# EAGLE design BareDuino schematic (EAGLE 7.1.0)
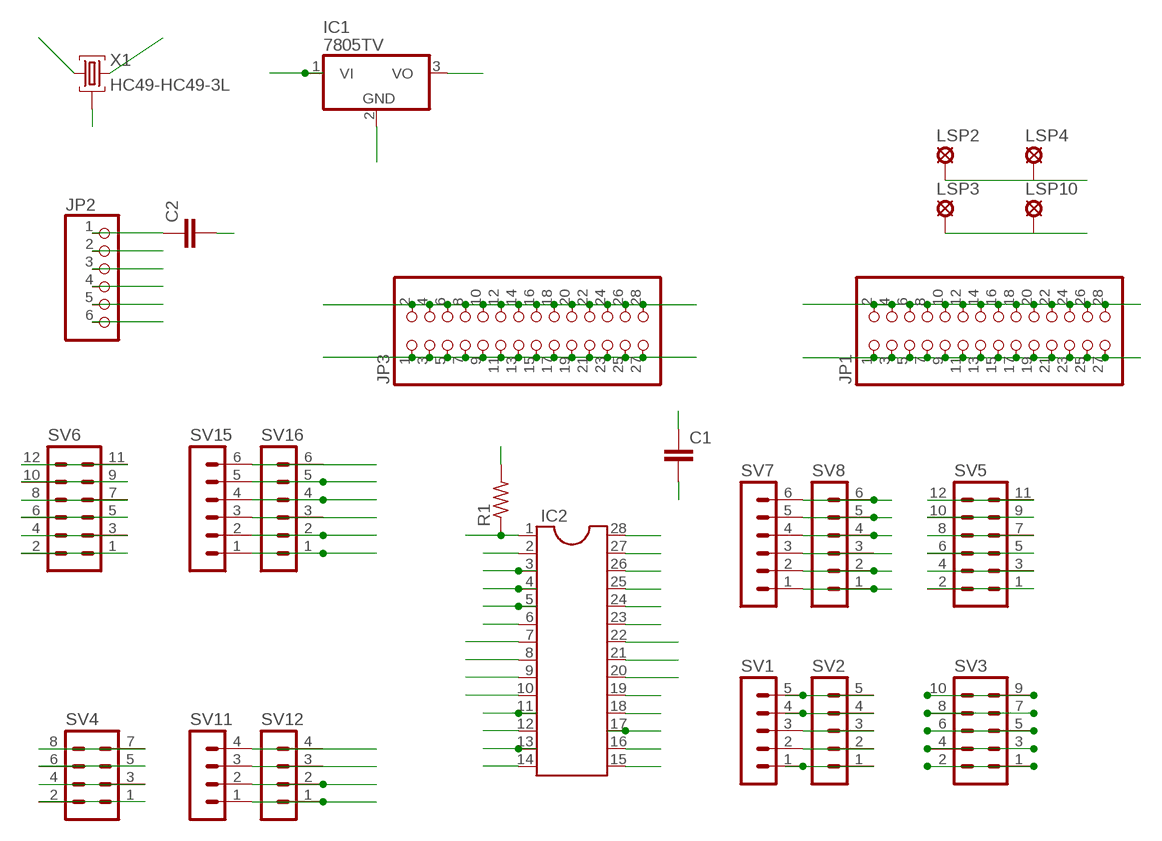
[diagram p0: schematic, sheet 1]

## Parts
C1  C5/2.5  [C5B2.5]
C2  C5/2.5  [C5B2.5]
IC1  7805TV  [TO220V]
IC2  DIL28-3  [DIL28-3]
JP1  PINHD-2X14  [2X14]
JP2  PINHD-1X6  [1X06]
JP3  PINHD-2X14  [2X14]
LSP2  SE14  [SE14]
LSP3  SE14  [SE14]
LSP4  LSP10  [LSP10]
LSP10  LSP10  [LSP10]
R1  R-US_0204/5  [0204/5]
SV1  MA05-1  [MA05-1]
SV2  MA05-1  [MA05-1]
SV3  MA05-2  [MA05-2]
SV4  MA04-2  [MA04-2]
SV5  MA06-2  [MA06-2]
SV6  MA06-2  [MA06-2]
SV7  MA06-1  [MA06-1]
SV8  MA06-1  [MA06-1]
SV11  MA04-1  [MA04-1]
SV12  MA04-1  [MA04-1]
SV15  MA06-1  [MA06-1]
SV16  MA06-1  [MA06-1]
X1  HC49-HC49-3L  [HC49-3L]

## Nets
CLK-9: IC2.9 X1.1
CLK-10: IC2.10 X1.3
DIP2: IC2.2 JP2.3 SV15.5 SV16.5
DIP3: IC2.3 JP2.2 SV15.4 SV16.4
DIP4: IC2.4 SV15.3 SV16.3
DIP5: IC2.5 SV15.2 SV16.2
DIP6: IC2.6 SV15.1 SV16.1
DIP11: IC2.11 SV11.4 SV12.4
DIP12: IC2.12 SV11.3 SV12.3
DIP13: IC2.13 SV11.2 SV12.2
DIP14: IC2.14 SV11.1 SV12.1
DIP15: IC2.15 SV1.1 SV2.1
DIP16: IC2.16 SV1.2 SV2.2
DIP17: IC2.17 SV1.3 SV2.3
DIP18: IC2.18 SV1.4 SV2.4
DIP19: IC2.19 SV1.5 SV2.5
DIP23: IC2.23 SV7.1 SV8.1
DIP24: IC2.24 SV7.2 SV8.2
DIP25: IC2.25 SV7.3 SV8.3
DIP26: IC2.26 SV7.4 SV8.4
DIP27: IC2.27 SV7.5 SV8.5
DIP28: IC2.28 SV7.6 SV8.6
GND: C1.1 IC1.2(GND) IC2.8 IC2.22 JP1.2 JP1.4 JP1.6 JP1.8 JP1.10 JP1.12 JP1.14 JP1.16 JP1.18 JP1.20 JP1.22 JP1.24 JP1.26 JP1.28 JP2.5 JP2.6 JP3.1 JP3.3 JP3.5 JP3.7 JP3.9 JP3.11 JP3.13 JP3.15 JP3.17 JP3.19 JP3.21 JP3.23 JP3.25 JP3.27 LSP3.MP LSP10.MP X1.2
N$1: SV5.11 SV5.12
N$2: SV5.9 SV5.10
N$3: SV5.7 SV5.8
N$4: SV5.5 SV5.6
N$5: SV5.3 SV5.4
N$6: SV5.1 SV5.2
N$7: SV4.7 SV4.8
N$8: SV4.5 SV4.6
N$9: SV4.3 SV4.4
N$10: SV4.1 SV4.2
N$11: SV6.11 SV6.12
N$12: SV3.5 SV3.6
N$13: SV3.7 SV3.8
N$14: SV3.9 SV3.10
N$15: SV3.3 SV3.4
N$16: SV3.1 SV3.2
N$17: SV6.9 SV6.10
N$18: SV6.7 SV6.8
N$19: SV6.5 SV6.6
N$20: SV6.3 SV6.4
N$21: C2.1 JP2.1
N$22: SV6.1 SV6.2
RST: C2.2 IC2.1 R1.1 SV15.6 SV16.6
VCC: C1.2 IC1.3(VO) IC2.7 IC2.20 IC2.21 JP1.1 JP1.3 JP1.5 JP1.7 JP1.9 JP1.11 JP1.13 JP1.15 JP1.17 JP1.19 JP1.21 JP1.23 JP1.25 JP1.27 JP2.4 JP3.2 JP3.4 JP3.6 JP3.8 JP3.10 JP3.12 JP3.14 JP3.16 JP3.18 JP3.20 JP3.22 JP3.24 JP3.26 JP3.28 R1.2
VIN: IC1.1(VI) LSP2.MP LSP4.MP

## Library data of the parts
C1 C2 = capacitor-wima:C: CAPACITOR naming: grid - package width
IC1 = linear:78*: Positive VOLTAGE REGULATOR Source: http://cache.national.com/ds/LM/LM78L05.pdf http://www.fairchildsemi.com/ds/LM/LM7805.pdf
IC2 = ic-package:DIL28: Dual In Line
JP1 JP3 = pinhead:PINHD-2X14: PIN HEADER
JP2 = pinhead:PINHD-1X6: PIN HEADER
LSP2 LSP3 = solpad:SE14: SOLDER PAD E1553, drill 1,4mm, distributor Buerklin, 07F820
LSP4 LSP10 = solpad:LSP10: SOLDER PAD drill 1.0 mm, distributor Buerklin, 12H555
R1 = rcl:R-US_: RESISTOR, American symbol
SV1 SV2 = con-lstb:MA05-1: PIN HEADER; OC_FARNELL: unknown; OC_NEWARK: unknown
SV3 = con-lstb:MA05-2: PIN HEADER; OC_FARNELL: unknown; OC_NEWARK: unknown
SV4 = con-lstb:MA04-2: PIN HEADER; OC_FARNELL: unknown; OC_NEWARK: unknown
SV5 SV6 = con-lstb:MA06-2: PIN HEADER; OC_FARNELL: unknown; OC_NEWARK: unknown
SV7 SV8 SV15 SV16 = con-lstb:MA06-1: PIN HEADER; OC_FARNELL: unknown; OC_NEWARK: unknown
SV11 SV12 = con-lstb:MA04-1: PIN HEADER; OC_FARNELL: unknown; OC_NEWARK: unknown
X1 = IQD-Frequency-Products:HC49: Crystals; MFD: IQD Frequency Products

## Board
An ATMega328 breakout / protoboard
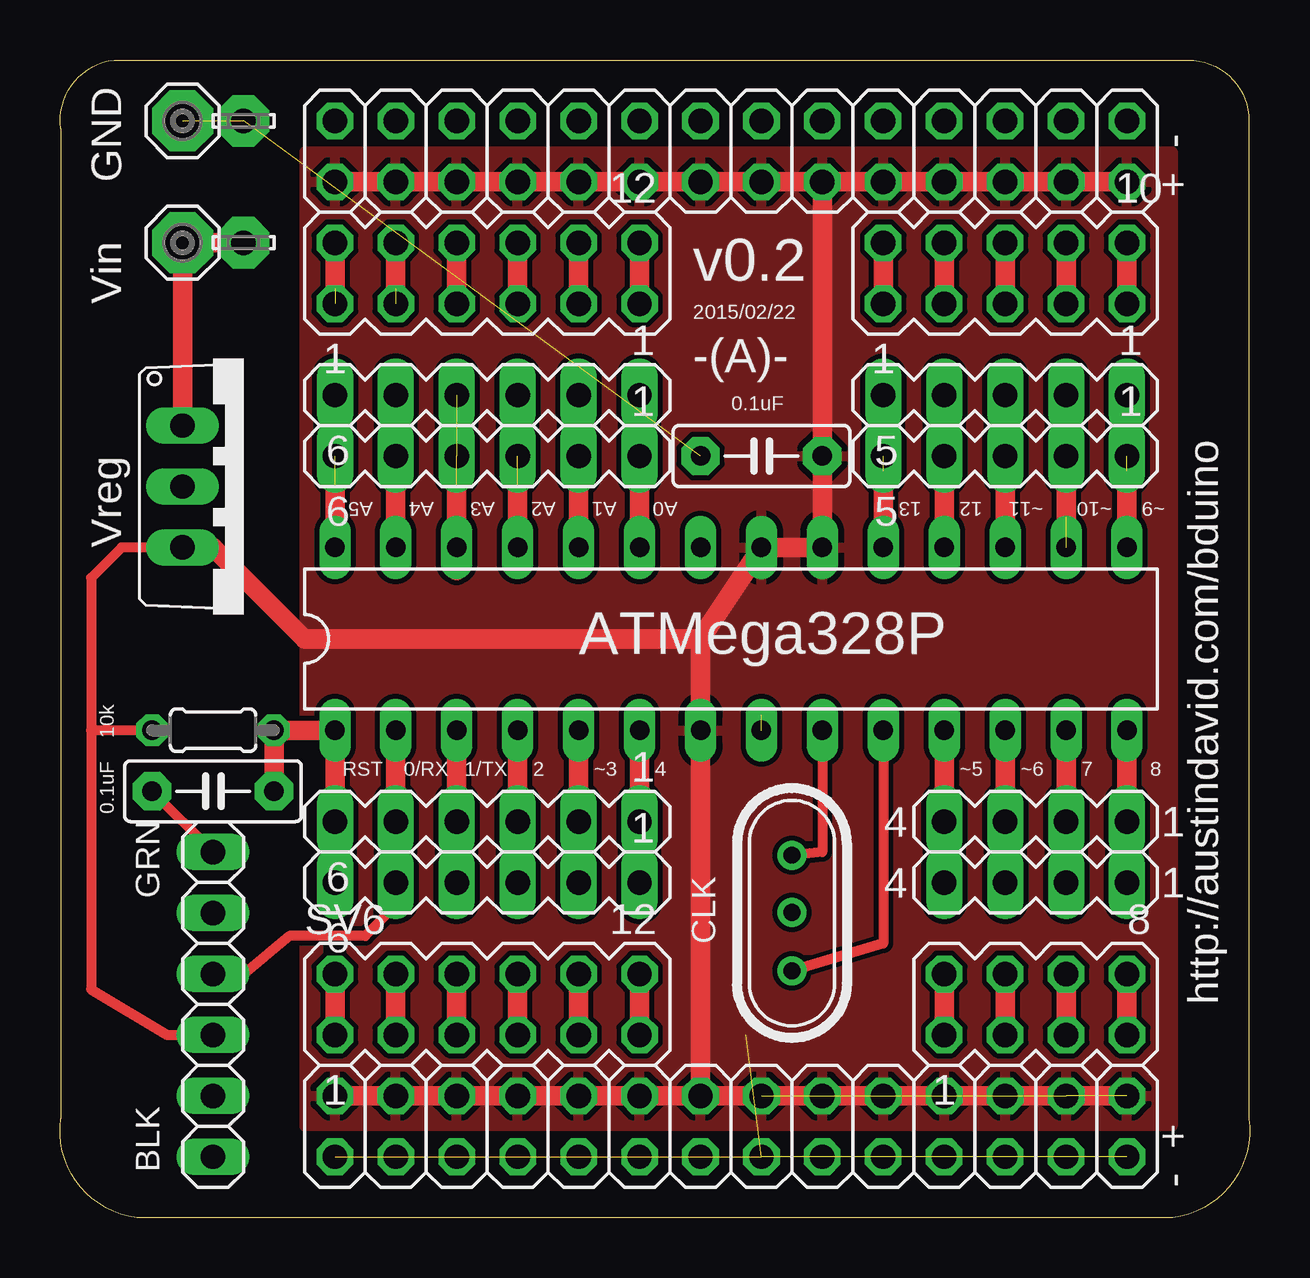
[diagram p1: board, top side]
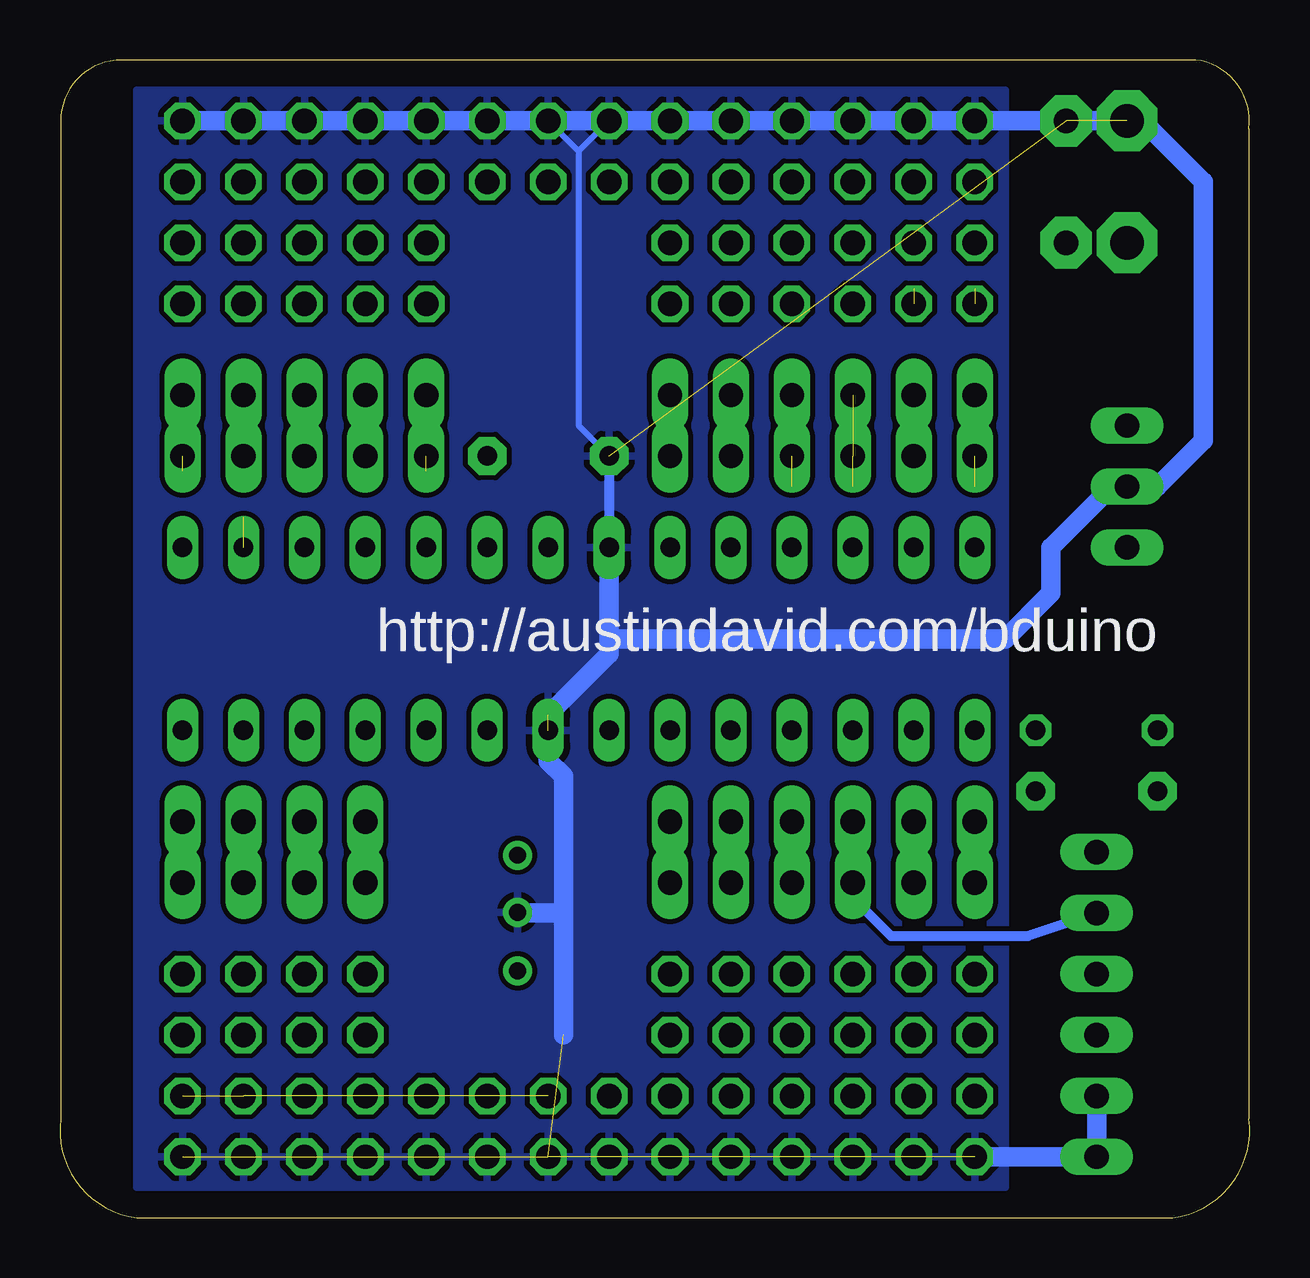
[diagram p2: board, bottom side, seen from below]

Size 49.59 x 48.26 mm. Coordinates in mm from the lower left corner, seen from the top.
Outline: 0.03,45.4 0.03,4.13 arc90 3.2,0 46.38,0 arc90 49.56,4.13 49.56,45.72 arc90 47.02,48.26 2.25,48.26 arc90 0.03,45.4
Copper layers (1*16): Top 0.035mm / dielectric 1.5mm / Bottom 0.035mm
Design rules "default": minimum track width 10mil, minimum drill 24mil, track to track 8mil, track to pad 8mil, pad to pad 8mil, via to via 8mil, smd to smd 8mil, copper to edge 40mil, drill to drill 8mil, minimum pad ring 10mil, minimum via ring 8mil, stop-mask expansion 4mil, vias tented up to drill 0mil, thermal gap 10mil

### Footprints (pad centres in the part's own frame; a part is rotated, then mirrored left to right if it is on the bottom)
C5B2.5 = drill 0.813 pad 1.6 octagon: 1 -2.54,0; 2 2.54,0
TO220V = drill 1.016 long: 1 -2.54,-2.54; 2 0,-2.54; 3 2.54,-2.54
DIL28-3 = drill 0.813 long: 1 -16.51,-3.81; 2 -13.97,-3.81; 3 -11.43,-3.81; 4 -8.89,-3.81; 5 -6.35,-3.81; 6 -3.81,-3.81; 7 -1.27,-3.81; 8 1.27,-3.81; 9 3.81,-3.81; 10 6.35,-3.81; 11 8.89,-3.81; 12 11.43,-3.81; 13 13.97,-3.81; 14 16.51,-3.81; 15 16.51,3.81; 16 13.97,3.81; 17 11.43,3.81; 18 8.89,3.81; 19 6.35,3.81; 20 3.81,3.81; 21 1.27,3.81; 22 -1.27,3.81; 23 -3.81,3.81; 24 -6.35,3.81; 25 -8.89,3.81; 26 -11.43,3.81; 27 -13.97,3.81; 28 -16.51,3.81
2X14 = drill 1.016 octagon: 1 -16.51,-1.27; 2 -16.51,1.27; 3 -13.97,-1.27; 4 -13.97,1.27; 5 -11.43,-1.27; 6 -11.43,1.27; 7 -8.89,-1.27; 8 -8.89,1.27; 9 -6.35,-1.27; 10 -6.35,1.27; 11 -3.81,-1.27; 12 -3.81,1.27; 13 -1.27,-1.27; 14 -1.27,1.27; 15 1.27,-1.27; 16 1.27,1.27; 17 3.81,-1.27; 18 3.81,1.27; 19 6.35,-1.27; 20 6.35,1.27; 21 8.89,-1.27; 22 8.89,1.27; 23 11.43,-1.27; 24 11.43,1.27; 25 13.97,-1.27; 26 13.97,1.27; 27 16.51,-1.27; 28 16.51,1.27
1X06 = drill 1.016 long: 1 -6.35,0; 2 -3.81,0; 3 -1.27,0; 4 1.27,0; 5 3.81,0; 6 6.35,0
SE14 = drill 1.397 pad 2.54 octagon: MP 0,0
LSP10 = drill 1.016 pad 2.159 octagon: MP 0,0
0204/5 = drill 0.813 octagon: 1 -2.54,0; 2 2.54,0
MA05-1 = drill 1.016 long: 1 -5.08,0; 2 -2.54,0; 3 0,0; 4 2.54,0; 5 5.08,0
MA05-2 = drill 1.016 octagon: 1 -5.08,-1.27; 2 -5.08,1.27; 3 -2.54,-1.27; 4 -2.54,1.27; 5 0,-1.27; 6 0,1.27; 7 2.54,-1.27; 8 2.54,1.27; 9 5.08,-1.27; 10 5.08,1.27
MA04-2 = drill 1.016 octagon: 1 -3.81,-1.27; 2 -3.81,1.27; 3 -1.27,-1.27; 4 -1.27,1.27; 5 1.27,-1.27; 6 1.27,1.27; 7 3.81,-1.27; 8 3.81,1.27
MA06-2 = drill 1.016 octagon: 1 -6.35,-1.27; 2 -6.35,1.27; 3 -3.81,-1.27; 4 -3.81,1.27; 5 -1.27,-1.27; 6 -1.27,1.27; 7 1.27,-1.27; 8 1.27,1.27; 9 3.81,-1.27; 10 3.81,1.27; 11 6.35,-1.27; 12 6.35,1.27
MA06-1 = drill 1.016 long: 1 -6.35,0; 2 -3.81,0; 3 -1.27,0; 4 1.27,0; 5 3.81,0; 6 6.35,0
MA04-1 = drill 1.016 long: 1 -3.81,0; 2 -1.27,0; 3 1.27,0; 4 3.81,0
HC49-3L = drill 0.7 pad 1.2: 1 -2.413,0; 2 -0.027,0; 3 2.413,0

### Placement (x,y rotation side)
C1  29.24,31.75 0 top
C2  6.38,17.78 0 top
IC1  7.65,30.48 270 top
IC2  27.97,24.13 0 top
JP1  27.97,3.81 180 top
JP2  6.38,8.89 270 top
JP3  27.97,44.45 180 top
LSP2  5.11,40.64 0 top
LSP3  5.11,45.72 0 top
LSP4  7.65,40.64 0 top
LSP10  7.65,45.72 0 top
R1  6.38,20.32 180 top
SV1  39.4,34.29 180 top
SV2  39.4,31.75 180 top
SV3  39.4,39.37 0 top
SV4  40.67,8.89 0 top
SV5  17.81,39.37 0 top
SV6  17.81,8.89 0 top
SV7  17.81,34.29 180 top
SV8  17.81,31.75 180 top
SV11  40.67,16.51 180 top
SV12  40.67,13.97 180 top
SV15  17.81,13.97 180 top
SV16  17.81,16.51 180 top
X1  30.51,12.7 270 top

### Tracks (layer width: path | path; a pad name or v marks a point on that pad's centre or on a via)
CLK-9
  Top 0.406: IC2.9 31.78,15.24 X1.1
CLK-10
  Top 0.406: IC2.10 34.32,11.43 X1.3
DIP2
  Top 0.305: SV16.5 SV15.5
  Top 0.406: JP2.3 7.65,10.16 9.55,11.75 12.73,11.75 14,13.02 SV15.5 14,12.7
  Top 0.813: SV16.5 IC2.2
DIP3
  Top 0.406: IC2.3 SV16.4 16.54,14.29
  Top 0.813: IC2.3 16.54,14.29 SV15.4
  Bottom 0.406: SV15.4 16.54,13.33 14.95,11.75 9.24,11.75 JP2.2
DIP4
  Top 0.305: IC2.4 19.08,17.14
  Top 0.813: SV15.3 SV16.3 19.08,17.14 19.08,20.64
DIP5
  Top 0.406: IC2.5 SV16.2 SV15.2
  Top 0.813: SV15.2 IC2.5
DIP6
  Top 0.305: SV16.1 SV15.1
  Top 0.406: IC2.6 SV16.1
  Top 0.813: 24.16,13.65 IC2.6
DIP11
  Top 0.406: SV12.4 SV11.4 | IC2.11 36.86,17.78
  Top 0.813: SV11.4 IC2.11
DIP12
  Top 0.406: SV11.3 SV12.3 | IC2.12 39.4,17.78
  Top 0.813: SV11.3 IC2.12
DIP13
  Top 0.406: SV11.2 SV12.2 | IC2.13 41.94,17.78
  Top 0.813: SV12.2 IC2.13
DIP14
  Top 0.406: SV11.1 SV12.1 | IC2.14 44.48,17.78
  Top 0.813: SV12.1 IC2.14
DIP15  (1 unrouted)
  Top 0.406: IC2.15 44.48,31.11
  Top 0.813: SV1.1 IC2.15
DIP16  (1 unrouted)
  Top 0.406: SV2.2 41.94,29.21
  Top 0.813: IC2.16 SV1.2
DIP17
  Top 0.406: IC2.17 SV2.3
  Top 0.813: SV1.3 IC2.17
DIP18
  Top 0.406: SV2.4 IC2.18
  Top 0.813: SV1.4 IC2.18
DIP19  (1 unrouted)
  Top 0.406: IC2.19 34.32,28.57 34.32,31.11
  Top 0.813: SV1.5 34.32,28.57
DIP23
  Top 0.406: IC2.23 24.16,28.57 SV8.1
  Top 0.813: SV7.1 24.16,28.57
DIP24
  Top 0.406: IC2.24 SV8.2
  Top 0.813: SV7.2 IC2.24
DIP25  (1 unrouted)
  Top 0.406: IC2.25 19.08,30.48
  Top 0.813: SV7.3 IC2.25
DIP26  (3 unrouted)
  Top 0.406: IC2.26 16.54,30.48
  Top 0.813: 16.54,26.99 SV7.4 16.22,34.61
DIP27
  Top 0.406: IC2.27 14,28.57 SV8.5
  Top 0.813: SV7.5 14,28.57
DIP28  (1 unrouted)
  Top 0.406: IC2.28 11.46,30.48
  Top 0.813: SV7.6 IC2.28
GND  (17 unrouted)
  Bottom 0.254: JP3.15 27.97,44.45 | JP3.13 27.97,44.45 | 27.97,44.45 27.97,33.02 C1.1
  Bottom 0.406: JP3.27 JP3.25 JP3.23 JP3.21 JP3.19 JP3.17 JP3.15 JP3.13 JP3.11 JP3.9 JP3.7 JP3.5 JP3.3 JP3.1 | C1.1 IC2.22
  Bottom 0.813: 5.74,2.54 JP2.6 | JP2.6 JP2.5 | IC2.8 29.24,19.05 28.6,18.41 28.6,12.7 | 28.6,12.7 30.48,12.7 X1.2 | 28.6,12.7 28.6,7.62 | IC2.22 26.7,24.13 | 26.7,24.13 26.7,23.5 29.24,20.96 | JP3.1 JP3.13 LSP3.MP 4.47,45.72 1.93,43.18 1.93,32.39 3.84,30.48 IC1.2 | 5.74,30.48 8.28,27.94 8.28,26.04 10.19,24.13 26.7,24.13 | JP2.6 JP1.28
  pour Bottom: 10.19,46.99 46.38,46.99 46.38,1.27 10.19,1.27
N$1
  Top 0.813: SV5.12 SV5.11
N$2
  Top 0.813: SV5.10 SV5.9
N$3
  Top 0.813: SV5.7 SV5.8
N$4
  Top 0.813: SV5.6 SV5.5
N$5  (1 unrouted)
  Top 0.813: SV5.4 14,38.73
N$6  (1 unrouted)
  Top 0.813: SV5.2 11.46,38.73
N$7
  Top 0.813: SV4.7 44.48,7.94 44.48,8.25 SV4.8
N$8
  Top 0.813: SV4.6 SV4.5
N$9
  Top 0.813: SV4.3 SV4.4
N$10
  Top 0.813: 36.86,8.25 SV4.1 SV4.2
N$11
  Top 0.813: SV6.11 SV6.12
N$12
  Top 0.813: SV3.5 SV3.6
N$13
  Top 0.813: SV3.8 SV3.7
N$14
  Top 0.813: SV3.9 SV3.10
N$15
  Top 0.813: SV3.4 SV3.3
N$16
  Top 0.813: SV3.2 SV3.1
N$17
  Top 0.813: SV6.10 SV6.9
N$18
  Top 0.813: SV6.7 SV6.8
N$19
  Top 0.813: SV6.6 SV6.5
N$20
  Top 0.813: SV6.3 SV6.4
N$21
  Top 0.406: JP2.1 C2.1
N$22
  Top 0.813: SV6.2 SV6.1
RST
  Top 0.813: SV15.6 SV16.6 IC2.1 R1.1 C2.2
VCC  (6 unrouted)
  Top 0.406: JP3.26 JP3.24 JP3.22 JP3.20 JP3.18 JP3.16 JP3.14 JP3.12 | 6.38,27.94 IC1.3 2.57,27.94 1.3,26.67 1.3,20.32 | IC2.7 26.7,21.59 | 1.3,20.32 1.3,9.52 4.47,7.62 JP2.4 | R1.2 1.3,20.32
  Top 0.813: JP3.12 JP3.10 JP3.8 JP3.6 JP3.4 JP3.2 | JP3.12 JP3.26 JP3.28 | JP3.12 C1.2 IC2.20 IC2.21 26.7,24.13 | 26.7,24.13 IC2.7 JP1.15 | 6.38,27.94 10.19,24.13 26.7,24.13 | JP1.27 JP1.25 JP1.23 JP1.21 JP1.19 JP1.17 JP1.15 | JP1.15 JP1.1
  pour Top: 10.19,44.45 46.38,44.45 46.38,3.81 10.19,3.81
VIN
  Top 0.813: IC1.1 LSP2.MP LSP4.MP

### Text on the board
tNames: GND | + - | v0.2 | Vin | 2015/02/22 | -(A)- | 0.1uF | A5 | A4 | A3 | A2 | A1 | A0 | 13 | 12 | ~11 | ~10 | ~9 | Vreg | ATMega328P | 10k | RST | 0/RX | 1/TX | 2 | ~3 | 4 | ~5 | ~6 | 7 | 8 | 0.1uF | GRN | CLK | http://austindavid.com/bduino | BLK | - +
bNames: http://austindavid.com/bduino